# Altium schematic sheet Esquematico.SchDoc
size A4; SheetNumber: 1; SheetTotal: 1
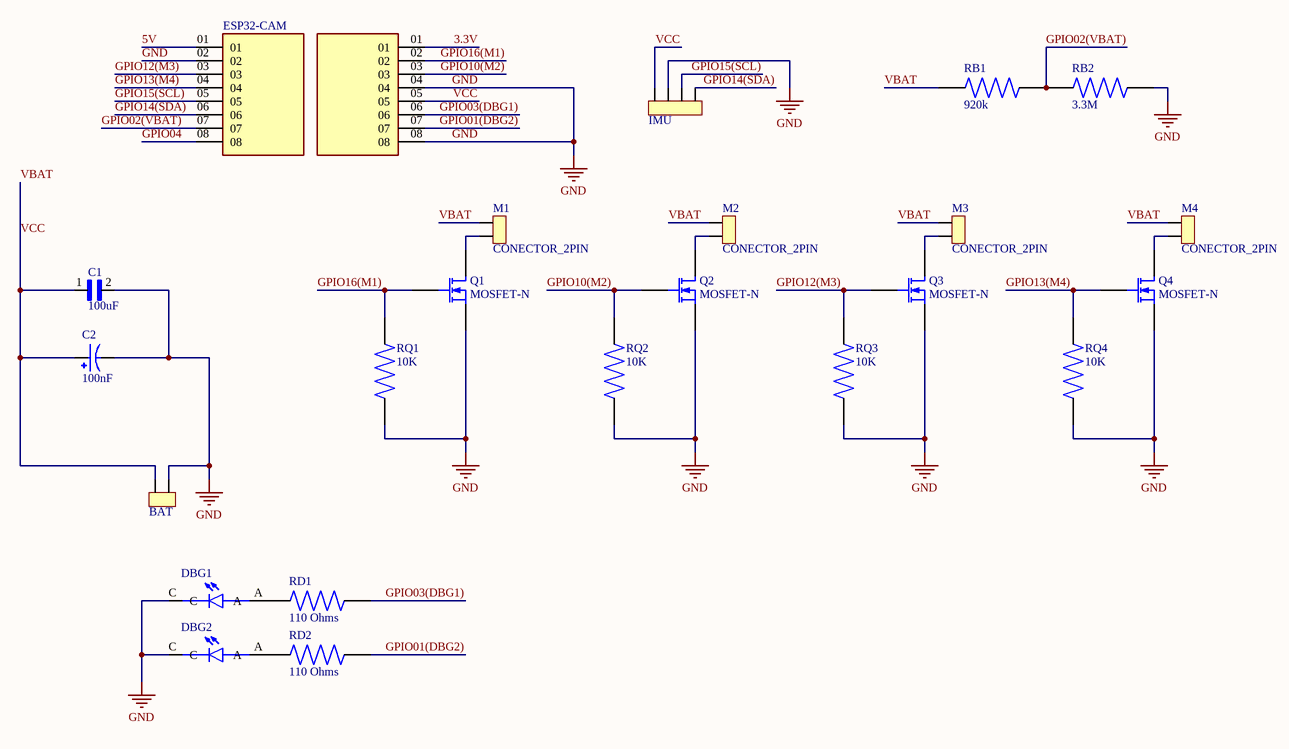
[diagram p0: Esquematico.SchDoc]

## Parts
?  SS-108-T-2  [SAMTEC_SS-108-T-2]  (value not drawn)
BAT  CONECTOR_2PIN  [CON2]  (value not drawn)
C1  100uF  [CAP_RDER73A104K5E1H03A]
C2  100nF  [CAPPRD500W60D1000H2000]
DBG1  WP7113ID  [LED_WP7113ID]  (value not drawn)
DBG2  WP7113ID  [LED_WP7113ID]  (value not drawn)
ESP32-CAM  SS-108-T-2  [SAMTEC_SS-108-T-2]  (value not drawn)
IMU  CONECTOR_4PIN  [CON4]  (value not drawn)
M1  CONECTOR_2PIN  [CON2]
M2  CONECTOR_2PIN  [CON2]
M3  CONECTOR_2PIN  [CON2]
M4  CONECTOR_2PIN  [CON2]
Q1  MOSFET-N  [TO220]
Q2  MOSFET-N  [TO220]
Q3  MOSFET-N  [TO220]
Q4  MOSFET-N  [TO220]
RB1  920k  [RESAD700W45L350D185]
RB2  3.3M  [RESAD700W45L350D185]
RD1  110 Ohms  [RESAD700W45L350D185]
RD2  110 Ohms  [RESAD700W45L350D185]
RQ1  10K  [RESAD700W45L350D185]
RQ2  10K  [RESAD700W45L350D185]
RQ3  10K  [RESAD700W45L350D185]
RQ4  10K  [RESAD700W45L350D185]

## Nets
GND: ?.04 ?.08 BAT.2 C1.2 C2.N DBG1.C DBG2.C ESP32-CAM.02 IMU.2 Q1.3(S) Q2.3(S) Q3.3(S) Q4.3(S) RB2.2 RQ1.1 RQ2.1 RQ3.1 RQ4.1
3.3V: ?.01
5V: ESP32-CAM.01
GPIO01(DBG2): ?.07 RD2.2
GPIO02(VBAT): ESP32-CAM.07 RB1.2 RB2.1
GPIO03(DBG1): ?.06 RD1.2
GPIO04: ESP32-CAM.08
GPIO10(M2): ?.03 Q2.1(G) RQ2.2
GPIO12(M3): ESP32-CAM.03 Q3.1(G) RQ3.2
GPIO13(M4): ESP32-CAM.04 Q4.1(G) RQ4.2
GPIO14(SDA): ESP32-CAM.06 IMU.4
GPIO15(SCL): ESP32-CAM.05 IMU.3
GPIO16(M1): ?.02 Q1.1(G) RQ1.2
VBAT: ?.05 BAT.1 C1.1 C2.P IMU.1 M1.2 M2.2 M3.2 M4.2 RB1.1  [also labelled VCC]
NetDBG1_A: DBG1.A RD1.1
NetDBG2_A: DBG2.A RD2.1
NetM1_1: M1.1 Q1.2(D)
NetM2_1: M2.1 Q2.2(D)
NetM3_1: M3.1 Q3.2(D)
NetM4_1: M4.1 Q4.2(D)

## Library data of the parts
? ESP32-CAM = SS-108-T-2: SS Series .100 Single Row Screw Machine Socket Strip; MF: Samtec; MP: SS-108-T-2; SnapEDA_Link: https://www.snapeda.com/parts/SS-108-T-2/Samtec/view-part/3323909/?ref=snap; Availability: Bad; Package: None; Value: *; Price: None; Check_prices: https://www.snapeda.com/parts/SS-108-T-2/Samtec/view-part/3323909/?ref=eda
C1 = RDER73A104K5E1H03A: Lead Capacitor X7R_EIA_ with Capacitance: 0.10F and Rated Voltage: 1000Vdc; MF: Murata; Value: *; Price: None; MP: RDER73A104K5E1H03A; SnapEDA_Link: https://www.snapeda.com/parts/RDER73A104K5E1H03A/Murata/view-part/4545952/?ref=snap; Package: Radial Murata; Availability: Unavailable
C2 = EEUFC2A470: 47F 100V Aluminum Electrolytic Capacitors Radial, Can; MP: EEU-FC2A470; MF: Panasonic Electronic; Package: RADIAL-2 Panasonic; Availability: In Stock; SnapEDA_Link: https://www.snapeda.com/parts/EEU-FC2A470/Panasonic%20Electronic%20Components/view-part/564661/?ref=snap; Price: None; Check_prices: https://www.snapeda.com/parts/EEU-FC2A470/Panasonic%20Electronic%20Components/view-part/564661/?ref=eda; Value: *
DBG1 DBG2 = WP7113ID: Red 617nm LED Indication - Discrete 2V Radial; MF: Kingbright; Price: None; MP: WP7113ID; Package: Radial Kingbright; Check_prices: https://www.snapeda.com/parts/WP7113ID/Kingbright/view-part/?ref=eda; Purchase-URL: https://pricing.snapeda.com/search/part/WP7113ID/?ref=eda; Availability: In Stock; Value: *; SnapEDA_Link: https://www.snapeda.com/parts/WP7113ID/Kingbright/view-part/?ref=snap
Q1-Q4 = MOSFET-N: N-Channel MOSFET
RB1 RB2 RD1 RD2 RQ1-RQ4 = 3-1623927-1: 1 MOhms Â±5% 0.25W, 1/4W Through Hole Resistor Axial - Carbon Film; MF: TE Connectivity; SnapEDA_Link: https://www.snapeda.com/parts/3-1623927-1/TE+Connectivity/view-part/?ref=snap; Package: None; Value: *; MP: 3-1623927-1; Check_prices: https://www.snapeda.com/parts/3-1623927-1/TE+Connectivity/view-part/?ref=eda